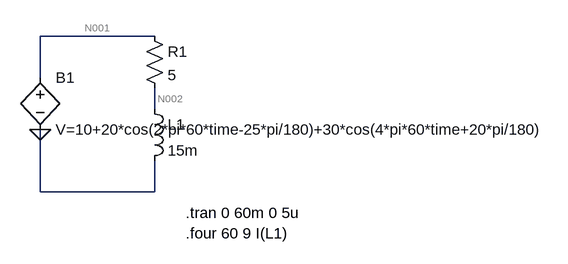
[diagram p0: schematic exercise12_schematic.asc]
exercise12_schematic.asc, the LTspice schematic file:
Version 4
SHEET 1 880 680
WIRE 96 48 96 112
WIRE 272 48 96 48
WIRE 272 160 272 128
WIRE 272 288 272 240
WIRE 96 288 272 288
WIRE 96 288 96 192
FLAG 96 192 0
SYMBOL bv 96 96 R0
SYMATTR InstName B1
SYMATTR Value V=10+20*cos(2*pi*60*time-25*pi/180)+30*cos(4*pi*60*time+20*pi/180)
SYMBOL res 256 32 R0
SYMATTR InstName R1
SYMATTR Value 5
SYMBOL ind 256 144 R0
SYMATTR InstName L1
SYMATTR Value 15m
TEXT 320 320 Left 2 !.tran 0 60m 0 5u
TEXT 320 352 Left 2 !.four 60 9 I(L1)

The netlist it stands for:
* exercise12_schematic.asc
B1 N001 0 V=10+20*cos(2*pi*60*time-25*pi/180)+30*cos(4*pi*60*time+20*pi/180)
R1 N001 N002 5
L1 N002 0 15m
.tran 0 60m 0 5u
.four 60 9 I(L1)
.backanno
.end

* Results of the author's LTspice run, read from the files saved beside the schematic
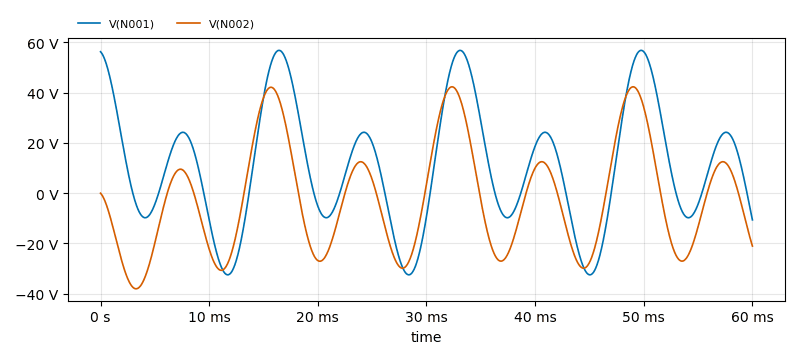
[diagram p1: Transient Analysis of exercise12_schematic.asc, plotted from the saved traces]
* Transient Analysis, 1 run:
*   V(N001): min -32.49 V, max 56.87 V, average 10.64 V, rms 26.67 V, last -10.68 V
*   V(N002): min -38.06 V, max 42.36 V, average -2.295 V, rms 21.89 V, last -21.09 V